# Altium project BLF571_test_cercuit.PrjPcb
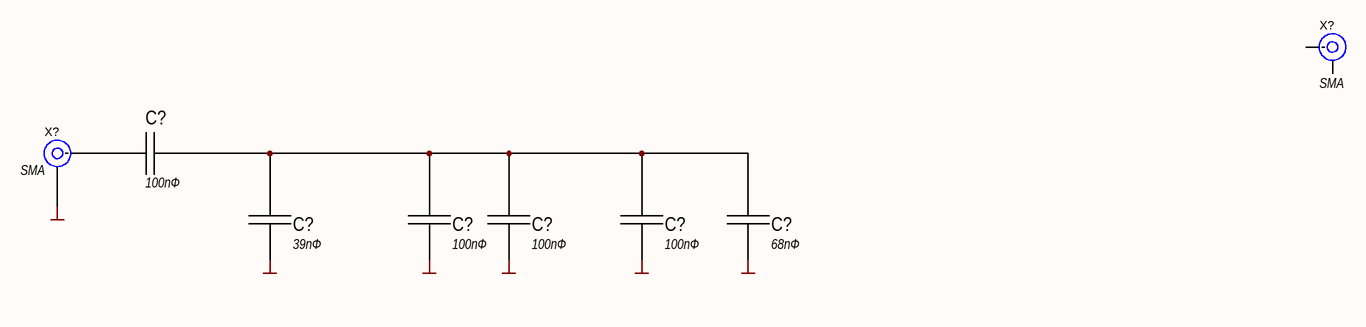
[diagram p0: BLF571.SchDoc]
1 sheet, 8 parts. Net scope: global (net labels, ports and power ports of the same name join across sheets).

## Sheet BLF571.SchDoc
size A4; SheetNumber: 1; SheetTotal: 1

### Parts
(Parts that share a designator on the sheet are numbered #1, #2 ... from top to bottom, then left to right.)
C?#1  100пФ  [C0603]
C?#2  100пФ  [C0603]
C?#3  100пФ  [C0603]
C?#4  100пФ  [C0603]
C?#5  39пФ  [C0603]
C?#6  68пФ  [C0603]
X?#1  SMA  [SMA-90deg]
X?#2  SMA  [SMA-90deg]

### Nets
GND: C?#2.2 C?#3.2 C?#4.2 C?#5.1 C?#6.1 X?#2.2(IN)
NetC?#1_1: C?#1.1 C?#2.1 C?#3.1 C?#4.1 C?#5.2 C?#6.2
NetC?#1_2: C?#1.2 X?#2.1(IN)

Not connected (* = marked no-connect by the designer): X?#1 1(IN) 2(IN)

### Library data of the parts
C?#1-C?#4 = C0603-C0G(NP0)-50В-100пФ ±1%: Manufacturer: No name; Tolerance: ±1%; Power/Voltage: 50В; Group: Конденсаторы; Part Number: C0603-C0G(NP0)-50В-100пФ ±1%; Size code: 0603; Value: 100пФ; TKE: C0G(NP0); Temperature Range: –55 to 125°C
C?#5 = C0603-C0G(NP0)-50В-39пФ ±1%: Manufacturer: No name; Tolerance: ±1%; Power/Voltage: 50В; Group: Конденсаторы; Part Number: C0603-C0G(NP0)-50В-39пФ ±1%; Size code: 0603; Value: 39пФ; TKE: C0G(NP0); Temperature Range: –55 to 125°C
C?#6 = C0603-C0G(NP0)-50В-68пФ ±1%: Manufacturer: No name; Tolerance: ±1%; Power/Voltage: 50В; Group: Конденсаторы; Part Number: C0603-C0G(NP0)-50В-68пФ ±1%; Size code: 0603; Value: 68пФ; TKE: C0G(NP0); Temperature Range: –55 to 125°C
X?#1 X?#2 = SMA: RF; Model: *; Manufacturer: *; ComponentKind: *; Docs: *